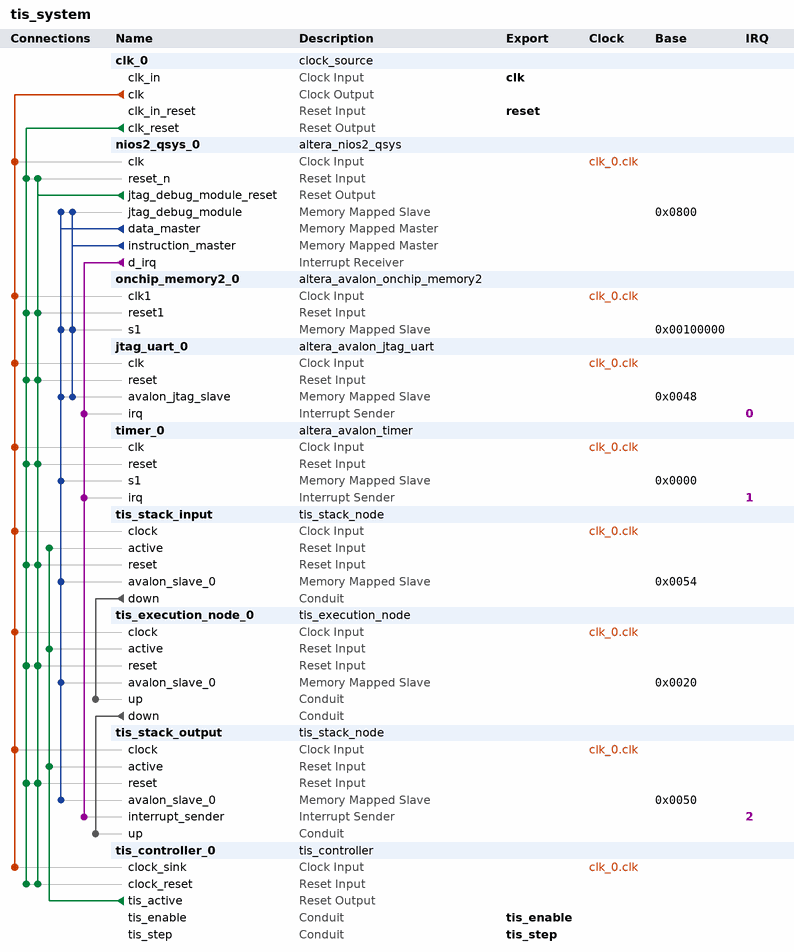
[diagram p0: system contents]
# Platform Designer (Qsys) system tis_system, Cyclone V 5CSEMA5F31C6
# Parameters at their usual value, and those the tool derives, are not listed.
package require -exact qsys 18.1
create_system tis_system
set_project_property DEVICE_FAMILY {Cyclone V}
set_project_property DEVICE 5CSEMA5F31C6

add_instance clk_0 clock_source 18.1
set_instance_parameter_value clk_0 clockFrequency 50000000

add_instance nios2_qsys_0 altera_nios2_qsys 16.1
set_instance_parameter_value nios2_qsys_0 breakSlave nios2_qsys_0.jtag_debug_module
set_instance_parameter_value nios2_qsys_0 exceptionSlave onchip_memory2_0.s1
set_instance_parameter_value nios2_qsys_0 icache_size 4096
set_instance_parameter_value nios2_qsys_0 impl Tiny
set_instance_parameter_value nios2_qsys_0 mmu_TLBMissExcSlave None
set_instance_parameter_value nios2_qsys_0 resetSlave onchip_memory2_0.s1
set_instance_parameter_value nios2_qsys_0 resetrequest_enabled true

add_instance onchip_memory2_0 altera_avalon_onchip_memory2 18.1
set_instance_parameter_value onchip_memory2_0 dataWidth 32
set_instance_parameter_value onchip_memory2_0 dualPort false
set_instance_parameter_value onchip_memory2_0 initMemContent true
set_instance_parameter_value onchip_memory2_0 initializationFileName onchip_mem.hex
set_instance_parameter_value onchip_memory2_0 memorySize 262144

add_instance jtag_uart_0 altera_avalon_jtag_uart 18.1
set_instance_parameter_value jtag_uart_0 simInteractiveOptions NO_INTERACTIVE_WINDOWS

add_instance timer_0 altera_avalon_timer 18.1
set_instance_parameter_value timer_0 period 1
set_instance_parameter_value timer_0 periodUnits MSEC

add_instance tis_stack_input tis_stack_node 1.0
set_instance_parameter_value tis_stack_input buffer_length 15

add_instance tis_execution_node_0 tis_execution_node 1.0

add_instance tis_stack_output tis_stack_node 1.0
set_instance_parameter_value tis_stack_output buffer_length 15

add_instance tis_controller_0 tis_controller 1.0

# connections
add_connection clk_0.clk jtag_uart_0.clk clock
add_connection clk_0.clk nios2_qsys_0.clk clock
add_connection clk_0.clk onchip_memory2_0.clk1 clock
add_connection clk_0.clk timer_0.clk clock
add_connection clk_0.clk tis_controller_0.clock_sink clock
add_connection clk_0.clk tis_execution_node_0.clock clock
add_connection clk_0.clk tis_stack_input.clock clock
add_connection clk_0.clk tis_stack_output.clock clock
add_connection clk_0.clk_reset jtag_uart_0.reset reset
add_connection clk_0.clk_reset nios2_qsys_0.reset_n reset
add_connection clk_0.clk_reset onchip_memory2_0.reset1 reset
add_connection clk_0.clk_reset timer_0.reset reset
add_connection clk_0.clk_reset tis_controller_0.clock_reset reset
add_connection clk_0.clk_reset tis_execution_node_0.reset reset
add_connection clk_0.clk_reset tis_stack_input.reset reset
add_connection clk_0.clk_reset tis_stack_output.reset reset
add_connection nios2_qsys_0.jtag_debug_module_reset jtag_uart_0.reset reset
add_connection nios2_qsys_0.jtag_debug_module_reset nios2_qsys_0.reset_n reset
add_connection nios2_qsys_0.jtag_debug_module_reset onchip_memory2_0.reset1 reset
add_connection nios2_qsys_0.jtag_debug_module_reset timer_0.reset reset
add_connection nios2_qsys_0.jtag_debug_module_reset tis_controller_0.clock_reset reset
add_connection nios2_qsys_0.jtag_debug_module_reset tis_execution_node_0.reset reset
add_connection nios2_qsys_0.jtag_debug_module_reset tis_stack_input.reset reset
add_connection nios2_qsys_0.jtag_debug_module_reset tis_stack_output.reset reset
add_connection tis_controller_0.tis_active tis_execution_node_0.active reset
add_connection tis_controller_0.tis_active tis_stack_input.active reset
add_connection tis_controller_0.tis_active tis_stack_output.active reset
add_connection nios2_qsys_0.data_master jtag_uart_0.avalon_jtag_slave avalon
set_connection_parameter_value nios2_qsys_0.data_master/jtag_uart_0.avalon_jtag_slave baseAddress 0x0048
add_connection nios2_qsys_0.data_master nios2_qsys_0.jtag_debug_module avalon
set_connection_parameter_value nios2_qsys_0.data_master/nios2_qsys_0.jtag_debug_module baseAddress 0x0800
add_connection nios2_qsys_0.data_master onchip_memory2_0.s1 avalon
set_connection_parameter_value nios2_qsys_0.data_master/onchip_memory2_0.s1 baseAddress 0x00100000
add_connection nios2_qsys_0.data_master timer_0.s1 avalon
set_connection_parameter_value nios2_qsys_0.data_master/timer_0.s1 baseAddress 0x0000
add_connection nios2_qsys_0.data_master tis_execution_node_0.avalon_slave_0 avalon
set_connection_parameter_value nios2_qsys_0.data_master/tis_execution_node_0.avalon_slave_0 baseAddress 0x0020
add_connection nios2_qsys_0.data_master tis_stack_input.avalon_slave_0 avalon
set_connection_parameter_value nios2_qsys_0.data_master/tis_stack_input.avalon_slave_0 baseAddress 0x0054
add_connection nios2_qsys_0.data_master tis_stack_output.avalon_slave_0 avalon
set_connection_parameter_value nios2_qsys_0.data_master/tis_stack_output.avalon_slave_0 baseAddress 0x0050
add_connection nios2_qsys_0.instruction_master jtag_uart_0.avalon_jtag_slave avalon
set_connection_parameter_value nios2_qsys_0.instruction_master/jtag_uart_0.avalon_jtag_slave baseAddress 0x0048
add_connection nios2_qsys_0.instruction_master nios2_qsys_0.jtag_debug_module avalon
set_connection_parameter_value nios2_qsys_0.instruction_master/nios2_qsys_0.jtag_debug_module baseAddress 0x0800
add_connection nios2_qsys_0.instruction_master onchip_memory2_0.s1 avalon
set_connection_parameter_value nios2_qsys_0.instruction_master/onchip_memory2_0.s1 baseAddress 0x00100000
add_connection tis_execution_node_0.down tis_stack_output.up conduit
add_connection tis_stack_input.down tis_execution_node_0.up conduit
add_connection nios2_qsys_0.d_irq jtag_uart_0.irq interrupt
set_connection_parameter_value nios2_qsys_0.d_irq/jtag_uart_0.irq irqNumber 0
add_connection nios2_qsys_0.d_irq timer_0.irq interrupt
set_connection_parameter_value nios2_qsys_0.d_irq/timer_0.irq irqNumber 1
add_connection nios2_qsys_0.d_irq tis_stack_output.interrupt_sender interrupt
set_connection_parameter_value nios2_qsys_0.d_irq/tis_stack_output.interrupt_sender irqNumber 2

# exported interfaces
add_interface clk clock sink
set_interface_property clk EXPORT_OF clk_0.clk_in
add_interface reset reset sink
set_interface_property reset EXPORT_OF clk_0.clk_in_reset
add_interface tis_enable conduit end
set_interface_property tis_enable EXPORT_OF tis_controller_0.tis_enable
add_interface tis_step conduit end
set_interface_property tis_step EXPORT_OF tis_controller_0.tis_step

set_interconnect_requirement {$system} qsys_mm.clockCrossingAdapter HANDSHAKE
set_interconnect_requirement {$system} qsys_mm.enableEccProtection FALSE
set_interconnect_requirement {$system} qsys_mm.insertDefaultSlave FALSE
set_interconnect_requirement {$system} qsys_mm.maxAdditionalLatency 1

save_system tis_system.qsys
